# EasyEDA Pro project pdb.eprj, board input-12-50
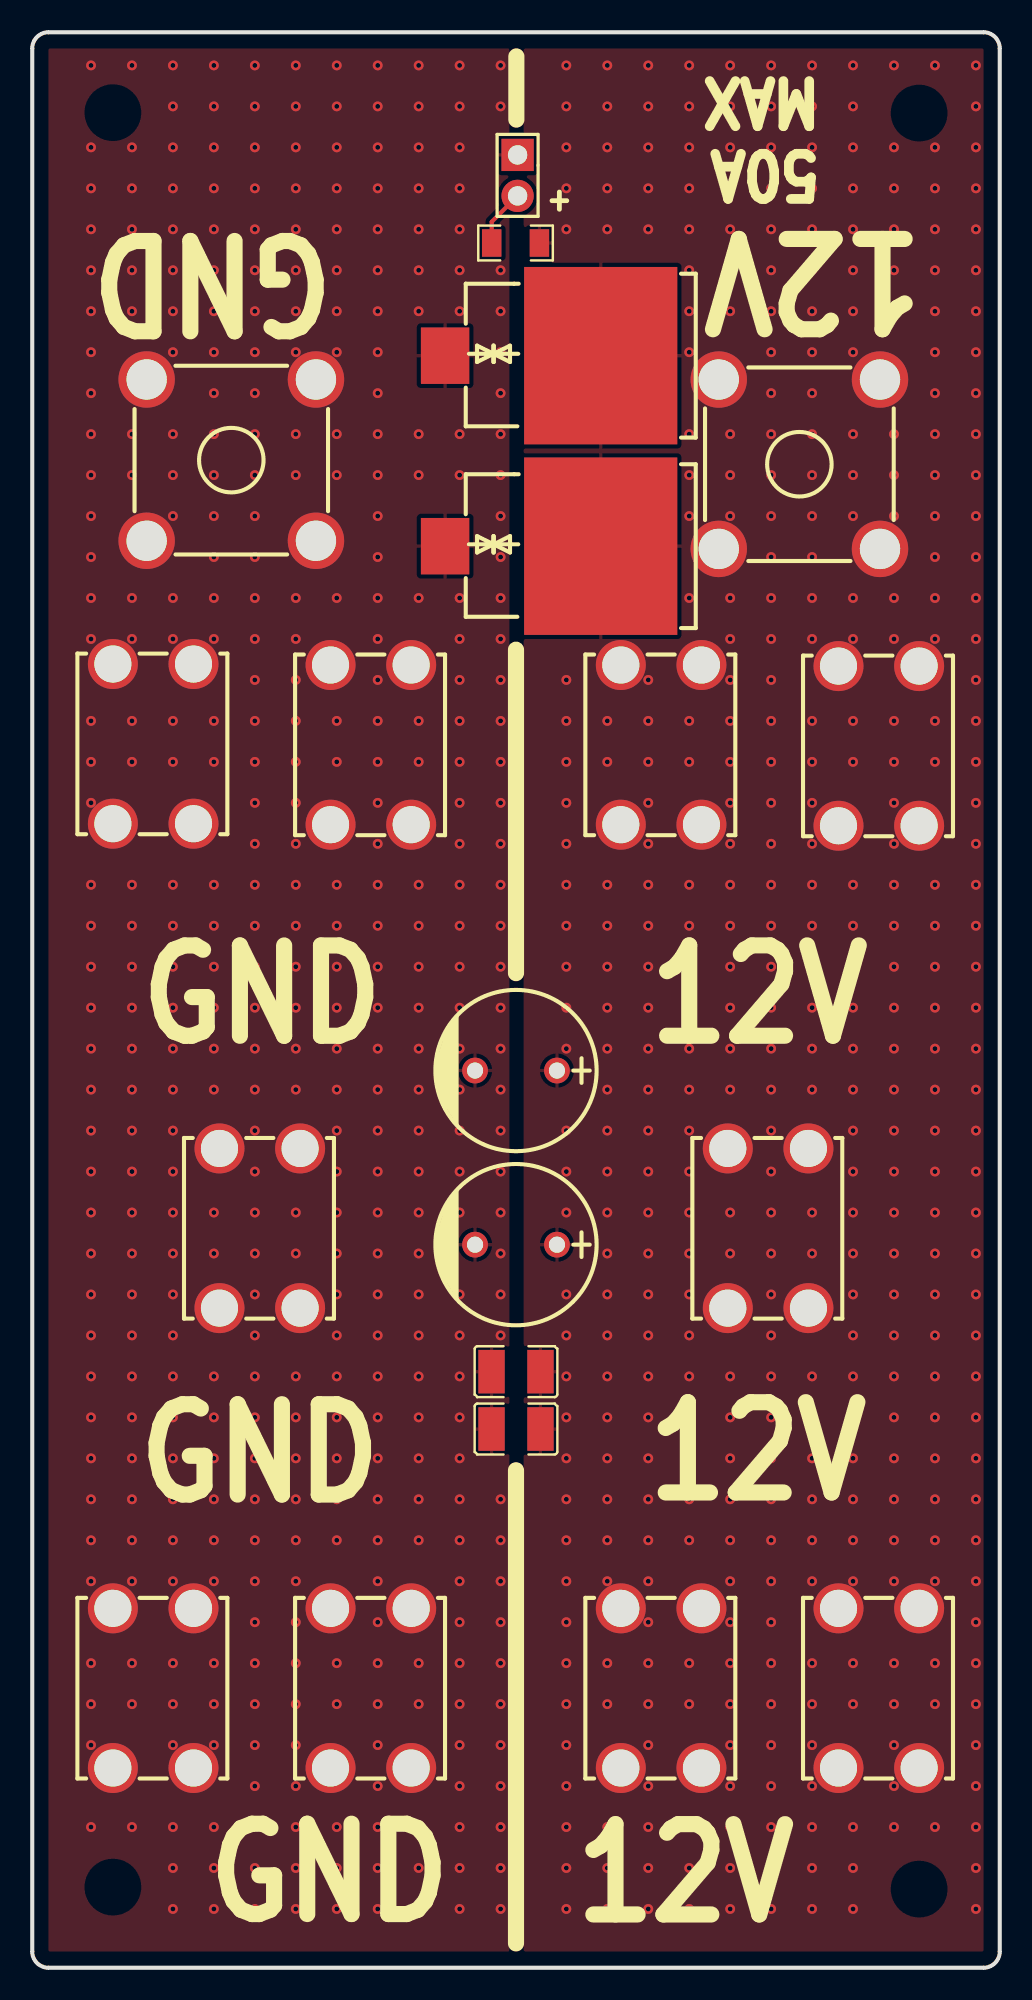
[diagram p3: board, top side]
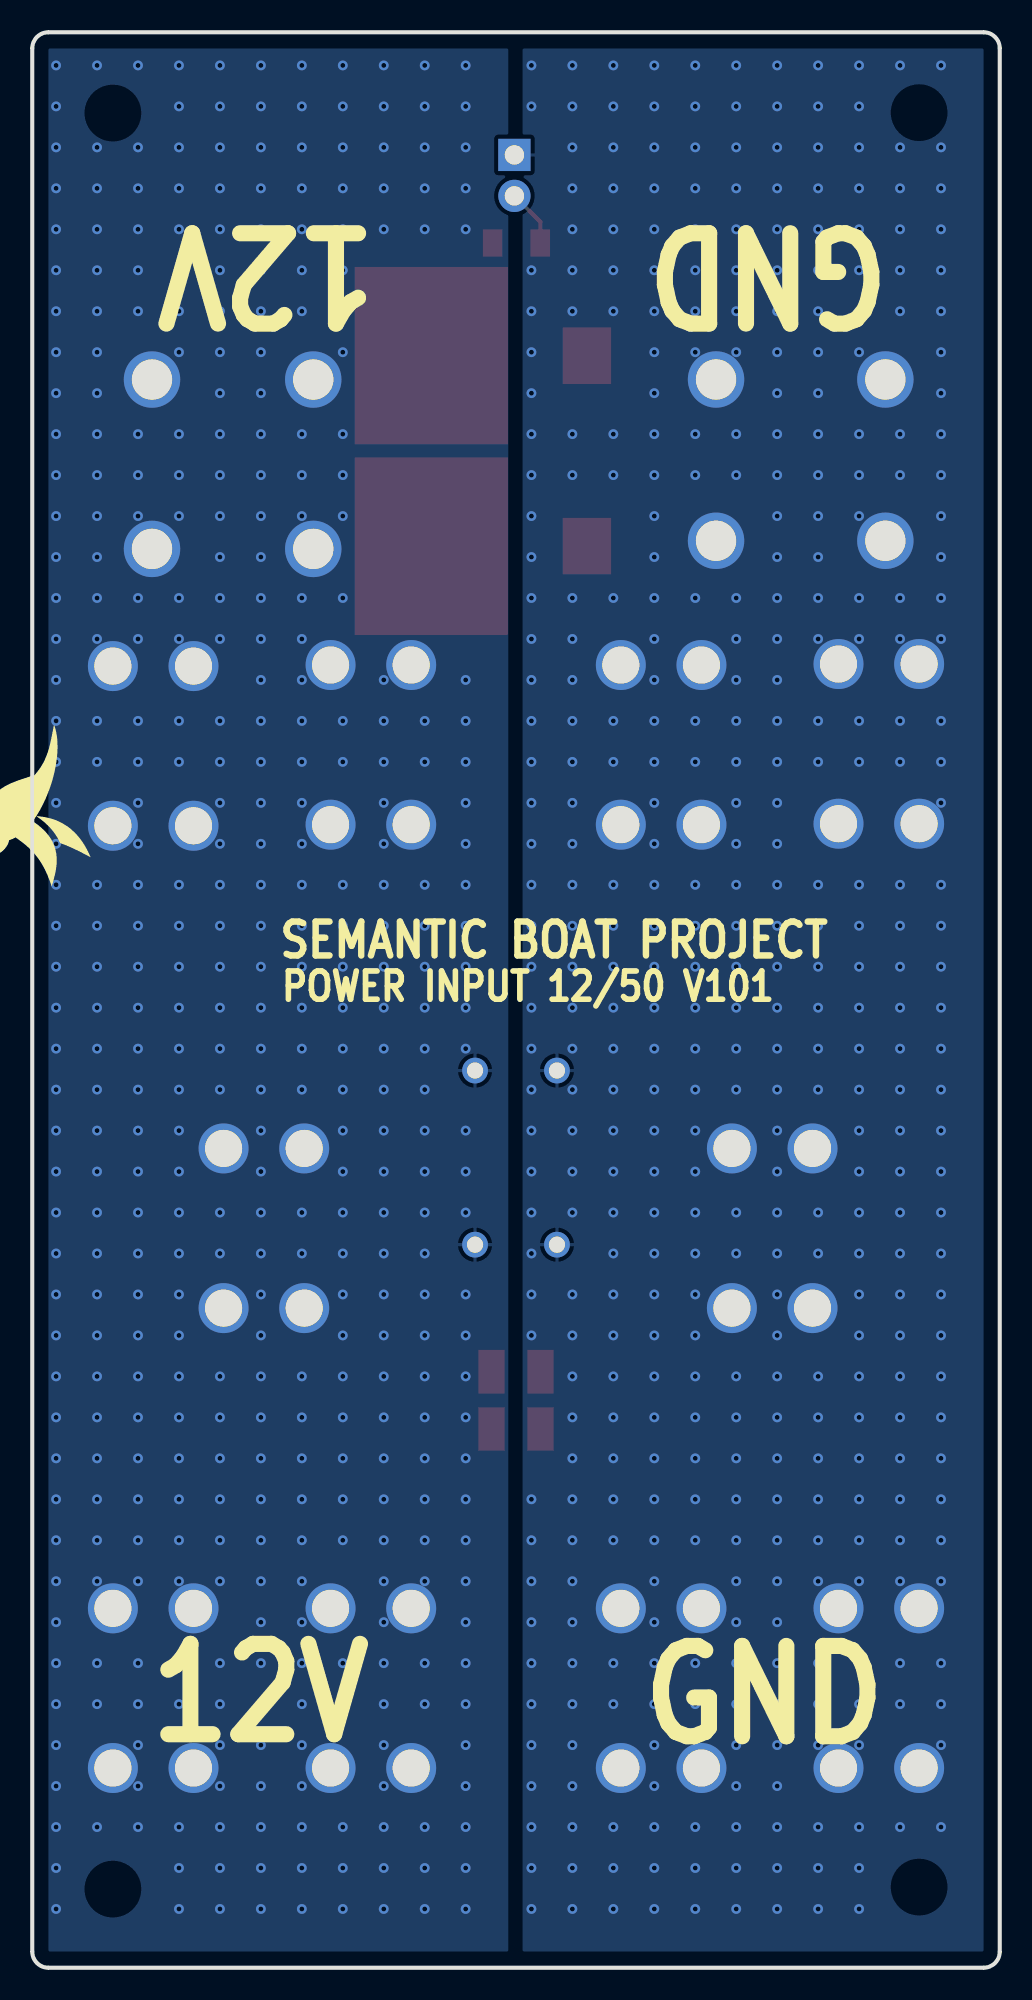
[diagram p4: board, bottom side, seen from below]

Outline 60 x 120 mm; copper layers: Top Layer, Bottom Layer. Coordinates in mm from the lower left corner of the outline.
Outline path: 0,119 0,1 arc(0.29,0.29) 1,0 59,0 arc(59.71,0.29) 60,1 60,119 arc(59.71,119.71) 59,120 1,120 arc(0.29,119.71) 0,119
Stack: Top Layer 0.035mm / Dielectric1 1.51mm FR4 er 4.5 / Bottom Layer 0.035mm

## Design rules (mm)
template: JLCPCB Capability(Two Layers Board)
spacing copperThickness1oz (default): track to track 0.102, other pairs 0.152 to 0.3
spacing copperThickness2oz: track to track 0.203, other pairs 0.152 to 0.3
track width copperThickness1oz (default): min 0.127, default 0.254, max 2.54
track width copperThickness2oz: min 0.203, default 0.254, max 2.54
differential pair differentialPair (default): width min 0.127, default 0.254, max 2.54; gap min 0.152, default 0.152
via viaSize (default): diameter min 0.5, default 0.61, max 10; hole min 0.3, default 0.305, max 6.3

## Placement (name value [footprint] x y rotation side)
C1  100nF  [C1210]  30 33.4 0 top
C2  100nF  [C1210]  30 36.96 0 top
C3  470uF  [CAP-TH_BD10.0-P5.00-D1.0-FD]  30 55.63 180 top
C4  470uF  [CAP-TH_BD10.0-P5.00-D1.0-FD]  30 44.83 180 top
CN5  80A/M5  [CONN-TH_T54120117-1300]  12.34 93.47 270 top
CN8  80A/M5  [CONN-TH_T54120117-1300]  47.57 93.22 180 top
D1  SM8S20CA  [DO-218AB_L13.5-W8.4-LS15.5-BI]  30.43 88.14 180 top
D2  SM8S20CA  [DO-218AB_L13.5-W8.4-LS15.5-BI]  30.43 99.95 180 top
H2  PZ254V-11-02P  [HDR-TH_2P-P2.54-V-M]  30.1 111.12 270 top
R2  10kΩ  [R1206]  29.97 106.93 0 top
U10  60A/M5  [TH_4P-L11.1-W9.2-P5.00]  39 75.82 90 top
U11  60A/M5  [TH_4P-L11.1-W9.2-P5.00]  52.5 75.75 90 top
U13  60A/M5  [TH_4P-L11.1-W9.2-P5.00]  39 17.33 90 top
U14  60A/M5  [TH_4P-L11.1-W9.2-P5.00]  45.63 45.85 90 top
U15  60A/M5  [TH_4P-L11.1-W9.2-P5.00]  52.5 17.33 90 top
U17  60A/M5  [TH_4P-L11.1-W9.2-P5.00]  21 17.33 90 top
U18  60A/M5  [TH_4P-L11.1-W9.2-P5.00]  21 75.82 90 top
U19  60A/M5  [TH_4P-L11.1-W9.2-P5.00]  7.5 75.88 90 top
U21  60A/M5  [TH_4P-L11.1-W9.2-P5.00]  7.5 17.33 90 top
U24  60A/M5  [TH_4P-L11.1-W9.2-P5.00]  14.11 45.85 90 top

## Footprints (pads in the part's own frame, mm; a bottom-side part is the same pattern mirrored in y, then rotated)
C1210
  rect 1.635x2.7 smd: 1(-1.518,0) 2(1.518,0)
CAP-TH_BD10.0-P5.00-D1.0-FD
  round 1.6 hole 1: 1(-2.54,0) 2(2.54,0)
CONN-TH_T54120117-1300
  round 3.5 hole 2.5: 1(-5,-5.25) 2(5,-5.25) 3(5,5.25) 4(-5,5.25)
DO-218AB_L13.5-W8.4-LS15.5-BI
  rect 9.5x11 smd: 1(-4.825,0)
  rect 3x3.5 smd: 2(4.825,0)
HDR-TH_2P-P2.54-V-M
  rect 2x2 hole 1.2: 1(-1.27,0)
  round 2 hole 1.2: 2(1.27,0)
R1206
  rect 1.208x1.701 smd: 1(-1.479,0) 2(1.479,0)
TH_4P-L11.1-W9.2-P5.00
  round 3.1 hole 2.3: 1(-4.95,-2.5) 2(-4.95,2.5) 3(4.95,2.5) 4(4.95,-2.5)

## Nets
As in the schematic.

## Via types
v1: diameter 0.61, hole 0.305, Top Layer to Bottom Layer, 849 vias

## Routing (per net, layer and track width the routed paths; a pad name or vN(x,y) marks a point on that pad's centre or on a via; arc(x,y) is an arc through that point)
$1N6693: length 3.6
  Top Layer w0.254: R2.1 28.49,108.25 H2.2
$1N7376:
  vias: v1(33.12,117.94) v1(33.12,115.4) v1(33.12,112.86) v1(33.12,110.32) v1(33.12,107.78) v1(33.12,79.84) v1(33.12,77.3) v1(33.12,74.76) v1(33.12,72.22) v1(33.12,69.68) v1(33.12,67.14) v1(33.12,64.6) v1(33.12,62.06) v1(33.12,59.52) v1(33.12,56.98) v1(33.12,51.9) v1(33.12,49.36) v1(33.12,46.82) v1(33.12,41.74) v1(33.12,39.2) v1(33.12,36.66) v1(33.12,34.12) v1(33.12,31.58) v1(33.12,29.04) v1(33.12,26.5) v1(33.12,23.96) v1(33.12,21.42) v1(33.12,18.88) v1(33.12,16.34) v1(33.12,13.8) v1(33.12,11.26) v1(33.12,8.72) v1(33.12,6.18) v1(33.12,3.64) v1(35.66,117.94) v1(35.66,115.4) v1(35.66,112.86) v1(35.66,110.32) v1(35.66,107.78) v1(35.66,77.3) v1(35.66,74.76) v1(35.66,67.14) v1(35.66,64.6) v1(35.66,62.06) v1(35.66,59.52) v1(35.66,56.98) v1(35.66,54.44) v1(35.66,51.9) v1(35.66,49.36) v1(35.66,46.82) v1(35.66,44.28) v1(35.66,41.74) v1(35.66,39.2) v1(35.66,36.66) v1(35.66,34.12) v1(35.66,31.58) v1(35.66,29.04) v1(35.66,26.5) v1(35.66,23.96) v1(35.66,18.88) v1(35.66,16.34) v1(35.66,8.72) v1(35.66,6.18) v1(35.66,3.64) v1(38.2,117.94) v1(38.2,115.4) v1(38.2,112.86) v1(38.2,110.32) v1(38.2,107.78) v1(38.2,79.84) v1(38.2,77.3) v1(38.2,74.76) v1(38.2,72.22) v1(38.2,69.68) v1(38.2,67.14) v1(38.2,64.6) v1(38.2,62.06) v1(38.2,59.52) v1(38.2,56.98) v1(38.2,54.44) v1(38.2,51.9) v1(38.2,49.36) v1(38.2,46.82) v1(38.2,44.28) v1(38.2,41.74) v1(38.2,39.2) v1(38.2,36.66) v1(38.2,34.12) v1(38.2,31.58) v1(38.2,29.04) v1(38.2,26.5) v1(38.2,23.96) v1(38.2,21.42) v1(38.2,18.88) v1(38.2,16.34) v1(38.2,13.8) v1(38.2,11.26) v1(38.2,8.72) v1(38.2,6.18) v1(38.2,3.64) v1(40.74,117.94) v1(40.74,115.4) v1(40.74,112.86) v1(40.74,110.32) v1(40.74,107.78) v1(40.74,105.24) v1(40.74,102.7) v1(40.74,100.16) v1(40.74,95.08) v1(40.74,92.54) v1(40.74,90) v1(40.74,84.92) v1(40.74,77.3) v1(40.74,74.76) v1(40.74,67.14) v1(40.74,64.6) v1(40.74,62.06) v1(40.74,59.52) v1(40.74,56.98) v1(40.74,54.44) v1(40.74,51.9) v1(40.74,49.36) v1(40.74,46.82) v1(40.74,44.28) v1(40.74,41.74) v1(40.74,39.2) v1(40.74,36.66) v1(40.74,34.12) v1(40.74,31.58) v1(40.74,29.04) v1(40.74,26.5) v1(40.74,18.88) v1(40.74,16.34) v1(40.74,8.72) v1(40.74,6.18) v1(40.74,3.64) v1(43.28,117.94) v1(43.28,115.4) v1(43.28,112.86) v1(43.28,110.32) v1(43.28,107.78) v1(43.28,105.24) v1(43.28,102.7) v1(43.28,95.08) v1(43.28,92.54) v1(43.28,90) v1(43.28,84.92) v1(43.28,82.38) v1(43.28,79.84) v1(43.28,77.3) v1(43.28,74.76) v1(43.28,72.22) v1(43.28,69.68) v1(43.28,67.14) v1(43.28,64.6) v1(43.28,62.06) v1(43.28,59.52) v1(43.28,56.98) v1(43.28,54.44) v1(43.28,46.82) v1(43.28,44.28) v1(43.28,36.66) v1(43.28,34.12) v1(43.28,31.58) v1(43.28,29.04) v1(43.28,26.5) v1(43.28,23.96) v1(43.28,21.42) v1(43.28,18.88) v1(43.28,16.34) v1(43.28,13.8) v1(43.28,11.26) v1(43.28,8.72) v1(43.28,6.18) v1(43.28,3.64) v1(45.82,117.94) v1(45.82,115.4) v1(45.82,112.86) v1(45.82,110.32) v1(45.82,107.78) v1(45.82,105.24) v1(45.82,102.7) v1(45.82,100.16) v1(45.82,97.62) v1(45.82,95.08) v1(45.82,92.54) v1(45.82,90) v1(45.82,87.46) v1(45.82,84.92) v1(45.82,82.38) v1(45.82,79.84) v1(45.82,77.3) v1(45.82,74.76) v1(45.82,72.22) v1(45.82,69.68) v1(45.82,67.14) v1(45.82,64.6) v1(45.82,62.06) v1(45.82,59.52) v1(45.82,56.98) v1(45.82,54.44) v1(45.82,51.9) v1(45.82,49.36) v1(45.82,46.82) v1(45.82,44.28) v1(45.82,41.74) v1(45.82,39.2) v1(45.82,36.66) v1(45.82,34.12) v1(45.82,31.58) v1(45.82,29.04) v1(45.82,26.5) v1(45.82,23.96) v1(45.82,21.42) v1(45.82,18.88) v1(45.82,16.34) v1(45.82,13.8) v1(45.82,11.26) v1(45.82,8.72) v1(45.82,6.18) v1(45.82,3.64) v1(48.36,117.94) v1(48.36,115.4) v1(48.36,112.86) v1(48.36,110.32) v1(48.36,107.78) v1(48.36,105.24) v1(48.36,102.7) v1(48.36,100.16) v1(48.36,97.62) v1(48.36,95.08) v1(48.36,92.54) v1(48.36,90) v1(48.36,87.46) v1(48.36,84.92) v1(48.36,82.38) v1(48.36,77.3) v1(48.36,74.76) v1(48.36,72.22) v1(48.36,69.68) v1(48.36,67.14) v1(48.36,64.6) v1(48.36,62.06) v1(48.36,59.52) v1(48.36,56.98) v1(48.36,54.44) v1(48.36,46.82) v1(48.36,44.28) v1(48.36,36.66) v1(48.36,34.12) v1(48.36,31.58) v1(48.36,29.04) v1(48.36,26.5) v1(48.36,23.96) v1(48.36,18.88) v1(48.36,16.34) v1(48.36,13.8) v1(48.36,11.26) v1(48.36,8.72) v1(48.36,6.18) v1(48.36,3.64) v1(50.9,117.94) v1(50.9,115.4) v1(50.9,112.86) v1(50.9,110.32) v1(50.9,107.78) v1(50.9,105.24) v1(50.9,102.7) v1(50.9,100.16) v1(50.9,95.08) v1(50.9,92.54) v1(50.9,90) v1(50.9,84.92) v1(50.9,82.38) v1(50.9,77.3) v1(50.9,74.76) v1(50.9,67.14) v1(50.9,64.6) v1(50.9,62.06) v1(50.9,59.52) v1(50.9,56.98) v1(50.9,54.44) v1(50.9,51.9) v1(50.9,49.36) v1(50.9,46.82) v1(50.9,44.28) v1(50.9,41.74) v1(50.9,39.2) v1(50.9,36.66) v1(50.9,34.12) v1(50.9,31.58) v1(50.9,29.04) v1(50.9,26.5) v1(50.9,23.96) v1(50.9,18.88) v1(50.9,16.34) v1(50.9,8.72) v1(50.9,6.18) v1(50.9,3.64) v1(53.44,117.94) v1(53.44,112.86) v1(53.44,110.32) v1(53.44,107.78) v1(53.44,105.24) v1(53.44,102.7) v1(53.44,95.08) v1(53.44,92.54) v1(53.44,90) v1(53.44,84.92) v1(53.44,82.38) v1(53.44,77.3) v1(53.44,74.76) v1(53.44,72.22) v1(53.44,69.68) v1(53.44,67.14) v1(53.44,64.6) v1(53.44,62.06) v1(53.44,59.52) v1(53.44,56.98) v1(53.44,54.44) v1(53.44,51.9) v1(53.44,49.36) v1(53.44,46.82) v1(53.44,44.28) v1(53.44,41.74) v1(53.44,39.2) v1(53.44,36.66) v1(53.44,34.12) v1(53.44,31.58) v1(53.44,29.04) v1(53.44,26.5) v1(53.44,23.96) v1(53.44,18.88) v1(53.44,16.34) v1(53.44,13.8) v1(53.44,11.26) v1(53.44,8.72) v1(55.98,117.94) v1(55.98,112.86) v1(55.98,110.32) v1(55.98,107.78) v1(55.98,105.24) v1(55.98,102.7) v1(55.98,100.16) v1(55.98,97.62) v1(55.98,95.08) v1(55.98,92.54) v1(55.98,90) v1(55.98,87.46) v1(55.98,84.92) v1(55.98,82.38) v1(55.98,77.3) v1(55.98,74.76) v1(55.98,67.14) v1(55.98,64.6) v1(55.98,62.06) v1(55.98,59.52) v1(55.98,56.98) v1(55.98,54.44) v1(55.98,51.9) v1(55.98,49.36) v1(55.98,46.82) v1(55.98,44.28) v1(55.98,41.74) v1(55.98,39.2) v1(55.98,36.66) v1(55.98,34.12) v1(55.98,31.58) v1(55.98,29.04) v1(55.98,26.5) v1(55.98,23.96) v1(55.98,18.88) v1(55.98,16.34) v1(55.98,8.72) v1(58.52,117.94) v1(58.52,115.4) v1(58.52,112.86) v1(58.52,110.32) v1(58.52,107.78) v1(58.52,105.24) v1(58.52,102.7) v1(58.52,100.16) v1(58.52,97.62) v1(58.52,95.08) v1(58.52,92.54) v1(58.52,90) v1(58.52,87.46) v1(58.52,84.92) v1(58.52,82.38) v1(58.52,79.84) v1(58.52,77.3) v1(58.52,74.76) v1(58.52,72.22) v1(58.52,69.68) v1(58.52,67.14) v1(58.52,64.6) v1(58.52,62.06) v1(58.52,59.52) v1(58.52,56.98) v1(58.52,54.44) v1(58.52,51.9) v1(58.52,49.36) v1(58.52,46.82) v1(58.52,44.28) v1(58.52,41.74) v1(58.52,39.2) v1(58.52,36.66) v1(58.52,34.12) v1(58.52,31.58) v1(58.52,29.04) v1(58.52,26.5) v1(58.52,23.96) v1(58.52,21.42) v1(58.52,18.88) v1(58.52,16.34) v1(58.52,13.8) v1(58.52,11.26) v1(58.52,8.72) v1(58.52,6.18) v1(58.52,3.64)
$1N8626:
  vias: v1(3.64,117.94) v1(3.64,112.86) v1(3.64,110.32) v1(3.64,107.78) v1(3.64,105.24) v1(3.64,102.7) v1(3.64,100.16) v1(3.64,97.62) v1(3.64,95.08) v1(3.64,92.54) v1(3.64,90) v1(3.64,87.46) v1(3.64,84.92) v1(3.64,82.38) v1(3.64,77.3) v1(3.64,74.76) v1(3.64,72.22) v1(3.64,67.14) v1(3.64,64.6) v1(3.64,62.06) v1(3.64,59.52) v1(3.64,56.98) v1(3.64,54.44) v1(3.64,51.9) v1(3.64,49.36) v1(3.64,46.82) v1(3.64,44.28) v1(3.64,41.74) v1(3.64,39.2) v1(3.64,36.66) v1(3.64,34.12) v1(3.64,31.58) v1(3.64,29.04) v1(3.64,26.5) v1(3.64,23.96) v1(3.64,18.88) v1(3.64,16.34) v1(3.64,13.8) v1(3.64,8.72) v1(6.18,117.94) v1(6.18,112.86) v1(6.18,110.32) v1(6.18,107.78) v1(6.18,105.24) v1(6.18,102.7) v1(6.18,95.08) v1(6.18,92.54) v1(6.18,84.92) v1(6.18,82.38) v1(6.18,77.3) v1(6.18,74.76) v1(6.18,67.14) v1(6.18,64.6) v1(6.18,62.06) v1(6.18,59.52) v1(6.18,56.98) v1(6.18,54.44) v1(6.18,51.9) v1(6.18,49.36) v1(6.18,46.82) v1(6.18,44.28) v1(6.18,41.74) v1(6.18,39.2) v1(6.18,36.66) v1(6.18,34.12) v1(6.18,31.58) v1(6.18,29.04) v1(6.18,26.5) v1(6.18,23.96) v1(6.18,18.88) v1(6.18,16.34) v1(6.18,8.72) v1(8.72,117.94) v1(8.72,115.4) v1(8.72,112.86) v1(8.72,110.32) v1(8.72,107.78) v1(8.72,105.24) v1(8.72,102.7) v1(8.72,100.16) v1(8.72,95.08) v1(8.72,92.54) v1(8.72,90) v1(8.72,84.92) v1(8.72,82.38) v1(8.72,77.3) v1(8.72,74.76) v1(8.72,67.14) v1(8.72,64.6) v1(8.72,62.06) v1(8.72,59.52) v1(8.72,56.98) v1(8.72,54.44) v1(8.72,51.9) v1(8.72,49.36) v1(8.72,46.82) v1(8.72,44.28) v1(8.72,41.74) v1(8.72,39.2) v1(8.72,36.66) v1(8.72,34.12) v1(8.72,31.58) v1(8.72,29.04) v1(8.72,26.5) v1(8.72,23.96) v1(8.72,18.88) v1(8.72,16.34) v1(8.72,13.8) v1(8.72,8.72) v1(8.72,6.18) v1(8.72,3.64) v1(11.26,117.94) v1(11.26,115.4) v1(11.26,112.86) v1(11.26,110.32) v1(11.26,107.78) v1(11.26,105.24) v1(11.26,102.7) v1(11.26,100.16) v1(11.26,97.62) v1(11.26,95.08) v1(11.26,92.54) v1(11.26,90) v1(11.26,87.46) v1(11.26,84.92) v1(11.26,82.38) v1(11.26,77.3) v1(11.26,74.76) v1(11.26,67.14) v1(11.26,64.6) v1(11.26,62.06) v1(11.26,59.52) v1(11.26,56.98) v1(11.26,54.44) v1(11.26,46.82) v1(11.26,44.28) v1(11.26,36.66) v1(11.26,34.12) v1(11.26,31.58) v1(11.26,29.04) v1(11.26,26.5) v1(11.26,23.96) v1(11.26,18.88) v1(11.26,16.34) v1(11.26,13.8) v1(11.26,8.72) v1(11.26,6.18) v1(11.26,3.64) v1(13.8,117.94) v1(13.8,115.4) v1(13.8,112.86) v1(13.8,110.32) v1(13.8,107.78) v1(13.8,105.24) v1(13.8,102.7) v1(13.8,100.16) v1(13.8,97.62) v1(13.8,95.08) v1(13.8,92.54) v1(13.8,90) v1(13.8,87.46) v1(13.8,84.92) v1(13.8,82.38) v1(13.8,79.84) v1(13.8,77.3) v1(13.8,74.76) v1(13.8,72.22) v1(13.8,69.68) v1(13.8,67.14) v1(13.8,64.6) v1(13.8,62.06) v1(13.8,59.52) v1(13.8,56.98) v1(13.8,54.44) v1(13.8,51.9) v1(13.8,49.36) v1(13.8,46.82) v1(13.8,44.28) v1(13.8,41.74) v1(13.8,39.2) v1(13.8,36.66) v1(13.8,34.12) v1(13.8,31.58) v1(13.8,29.04) v1(13.8,26.5) v1(13.8,23.96) v1(13.8,21.42) v1(13.8,18.88) v1(13.8,16.34) v1(13.8,13.8) v1(13.8,11.26) v1(13.8,8.72) v1(13.8,6.18) v1(13.8,3.64) v1(16.34,117.94) v1(16.34,115.4) v1(16.34,112.86) v1(16.34,110.32) v1(16.34,107.78) v1(16.34,105.24) v1(16.34,102.7) v1(16.34,100.16) v1(16.34,95.08) v1(16.34,92.54) v1(16.34,84.92) v1(16.34,82.38) v1(16.34,79.84) v1(16.34,77.3) v1(16.34,74.76) v1(16.34,72.22) v1(16.34,69.68) v1(16.34,67.14) v1(16.34,64.6) v1(16.34,62.06) v1(16.34,59.52) v1(16.34,56.98) v1(16.34,54.44) v1(16.34,46.82) v1(16.34,44.28) v1(16.34,36.66) v1(16.34,34.12) v1(16.34,31.58) v1(16.34,29.04) v1(16.34,26.5) v1(16.34,23.96) v1(16.34,21.42) v1(16.34,18.88) v1(16.34,16.34) v1(16.34,13.8) v1(16.34,11.26) v1(16.34,8.72) v1(16.34,6.18) v1(16.34,3.64) v1(18.88,117.94) v1(18.88,115.4) v1(18.88,112.86) v1(18.88,110.32) v1(18.88,107.78) v1(18.88,105.24) v1(18.88,102.7) v1(18.88,100.16) v1(18.88,95.08) v1(18.88,92.54) v1(18.88,84.92) v1(18.88,77.3) v1(18.88,74.76) v1(18.88,67.14) v1(18.88,64.6) v1(18.88,62.06) v1(18.88,59.52) v1(18.88,56.98) v1(18.88,54.44) v1(18.88,51.9) v1(18.88,49.36) v1(18.88,46.82) v1(18.88,44.28) v1(18.88,41.74) v1(18.88,39.2) v1(18.88,36.66) v1(18.88,34.12) v1(18.88,31.58) v1(18.88,29.04) v1(18.88,26.5) v1(18.88,18.88) v1(18.88,16.34) v1(18.88,8.72) v1(18.88,6.18) v1(18.88,3.64) v1(21.42,117.94) v1(21.42,115.4) v1(21.42,112.86) v1(21.42,110.32) v1(21.42,107.78) v1(21.42,105.24) v1(21.42,102.7) v1(21.42,100.16) v1(21.42,97.62) v1(21.42,95.08) v1(21.42,92.54) v1(21.42,90) v1(21.42,87.46) v1(21.42,84.92) v1(21.42,82.38) v1(21.42,79.84) v1(21.42,77.3) v1(21.42,74.76) v1(21.42,72.22) v1(21.42,69.68) v1(21.42,67.14) v1(21.42,64.6) v1(21.42,62.06) v1(21.42,59.52) v1(21.42,56.98) v1(21.42,54.44) v1(21.42,51.9) v1(21.42,49.36) v1(21.42,46.82) v1(21.42,44.28) v1(21.42,41.74) v1(21.42,39.2) v1(21.42,36.66) v1(21.42,34.12) v1(21.42,31.58) v1(21.42,29.04) v1(21.42,26.5) v1(21.42,23.96) v1(21.42,21.42) v1(21.42,18.88) v1(21.42,16.34) v1(21.42,13.8) v1(21.42,11.26) v1(21.42,8.72) v1(21.42,6.18) v1(21.42,3.64) v1(23.96,117.94) v1(23.96,115.4) v1(23.96,112.86) v1(23.96,110.32) v1(23.96,107.78) v1(23.96,105.24) v1(23.96,102.7) v1(23.96,95.08) v1(23.96,92.54) v1(23.96,84.92) v1(23.96,77.3) v1(23.96,74.76) v1(23.96,67.14) v1(23.96,64.6) v1(23.96,62.06) v1(23.96,59.52) v1(23.96,56.98) v1(23.96,54.44) v1(23.96,51.9) v1(23.96,49.36) v1(23.96,46.82) v1(23.96,44.28) v1(23.96,41.74) v1(23.96,39.2) v1(23.96,36.66) v1(23.96,34.12) v1(23.96,31.58) v1(23.96,29.04) v1(23.96,26.5) v1(23.96,18.88) v1(23.96,16.34) v1(23.96,8.72) v1(23.96,6.18) v1(23.96,3.64) v1(26.5,117.94) v1(26.5,115.4) v1(26.5,112.86) v1(26.5,110.32) v1(26.5,107.78) v1(26.5,105.24) v1(26.5,102.7) v1(26.5,95.08) v1(26.5,92.54) v1(26.5,84.92) v1(26.5,82.38) v1(26.5,79.84) v1(26.5,77.3) v1(26.5,74.76) v1(26.5,72.22) v1(26.5,69.68) v1(26.5,67.14) v1(26.5,64.6) v1(26.5,62.06) v1(26.5,59.52) v1(26.5,56.98) v1(26.5,54.44) v1(26.5,51.9) v1(26.5,49.36) v1(26.5,46.82) v1(26.5,41.74) v1(26.5,39.2) v1(26.5,36.66) v1(26.5,34.12) v1(26.5,31.58) v1(26.5,29.04) v1(26.5,26.5) v1(26.5,23.96) v1(26.5,21.42) v1(26.5,18.88) v1(26.5,16.34) v1(26.5,13.8) v1(26.5,11.26) v1(26.5,8.72) v1(26.5,6.18) v1(26.5,3.64) v1(29.04,117.94) v1(29.04,115.4) v1(29.04,105.24) v1(29.04,102.7) v1(29.04,100.16) v1(29.04,97.62) v1(29.04,95.08) v1(29.04,92.54) v1(29.04,90) v1(29.04,87.46) v1(29.04,84.92) v1(29.04,82.38) v1(29.04,79.84) v1(29.04,77.3) v1(29.04,74.76) v1(29.04,72.22) v1(29.04,69.68) v1(29.04,67.14) v1(29.04,64.6) v1(29.04,62.06) v1(29.04,59.52) v1(29.04,56.98) v1(29.04,54.44) v1(29.04,51.9) v1(29.04,49.36) v1(29.04,46.82) v1(29.04,44.28) v1(29.04,41.74) v1(29.04,39.2) v1(29.04,29.04) v1(29.04,26.5) v1(29.04,23.96) v1(29.04,21.42) v1(29.04,18.88) v1(29.04,16.34) v1(29.04,13.8) v1(29.04,11.26) v1(29.04,8.72) v1(29.04,6.18) v1(29.04,3.64)

## Copper pours and planes (outline as drawn; the poured copper is in the pictures)
$1N7376 on Top Layer: 30.48,120.27 60.58,120.27 60.58,-0.51 30.48,-0.51
$1N7376 on Bottom Layer: 30.48,120.27 60.45,120.27 60.45,-0.51 30.48,-0.51
$1N8626 on Top Layer: -0.51,120.4 29.59,120.4 29.59,-0.25 -0.51,-0.25
$1N8626 on Bottom Layer: -0.51,120.4 29.59,120.4 29.59,-0.25 -0.51,-0.25

## Text on the board
Bottom Silkscreen Layer: POWER INPUT 12/50 V101 | SEMANTIC BOAT PROJECT | GND | 12V
Top Silkscreen Layer: + | 50A / MAX | 12V | GND
